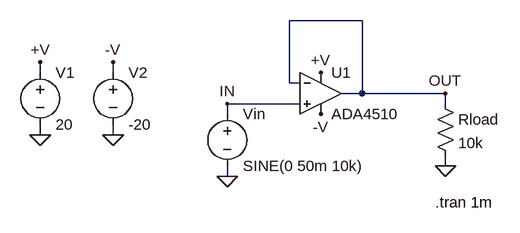
[diagram p0: schematic ADA4510.asc]
ADA4510.asc, the LTspice schematic file:
Version 4
SHEET 1 1240 700
WIRE 640 -1216 528 -1216
WIRE 144 -1136 144 -1152
WIRE 256 -1136 256 -1152
WIRE 528 -1120 528 -1216
WIRE 544 -1120 528 -1120
WIRE 640 -1104 640 -1216
WIRE 640 -1104 608 -1104
WIRE 768 -1104 640 -1104
WIRE 544 -1088 432 -1088
WIRE 768 -1088 768 -1104
WIRE 432 -1072 432 -1088
WIRE 144 -1040 144 -1056
WIRE 256 -1040 256 -1056
WIRE 768 -992 768 -1008
WIRE 432 -976 432 -992
FLAG 144 -1152 +V
FLAG 144 -1040 0
FLAG 432 -976 0
FLAG 768 -1104 OUT
FLAG 432 -1088 IN
FLAG 576 -1136 +V
FLAG 256 -1152 -V
FLAG 576 -1072 -V
FLAG 768 -992 0
FLAG 256 -1040 0
SYMBOL voltage 144 -1152 R0
WINDOW 123 0 0 Left 2
WINDOW 39 0 0 Left 2
SYMATTR InstName V1
SYMATTR Value 20
SYMBOL voltage 432 -1088 R0
WINDOW 123 24 146 Left 2
WINDOW 39 24 125 Left 2
SYMATTR InstName Vin
SYMATTR Value SINE(0 50m 10k)
SYMBOL voltage 256 -1152 R0
WINDOW 123 24 146 Left 2
WINDOW 39 24 125 Left 2
SYMATTR InstName V2
SYMATTR Value -20
SYMBOL res 752 -1104 R0
SYMATTR InstName Rload
SYMATTR Value 10k
SYMBOL ADA4510 576 -1168 R0
SYMATTR InstName U1
TEXT 752 -936 Left 2 !.tran 1m

The netlist it stands for:
* ADA4510.asc
V1 +V 0 20
Vin IN 0 SINE(0 50m 10k)
V2 -V 0 -20
Rload OUT 0 10k
* U1: ADA4510 (symbol ADA4510 not available, pins judged from their places): In+=IN In-=OUT V+=+V V-=-V OUT=OUT
.tran 1m
.backanno
.end